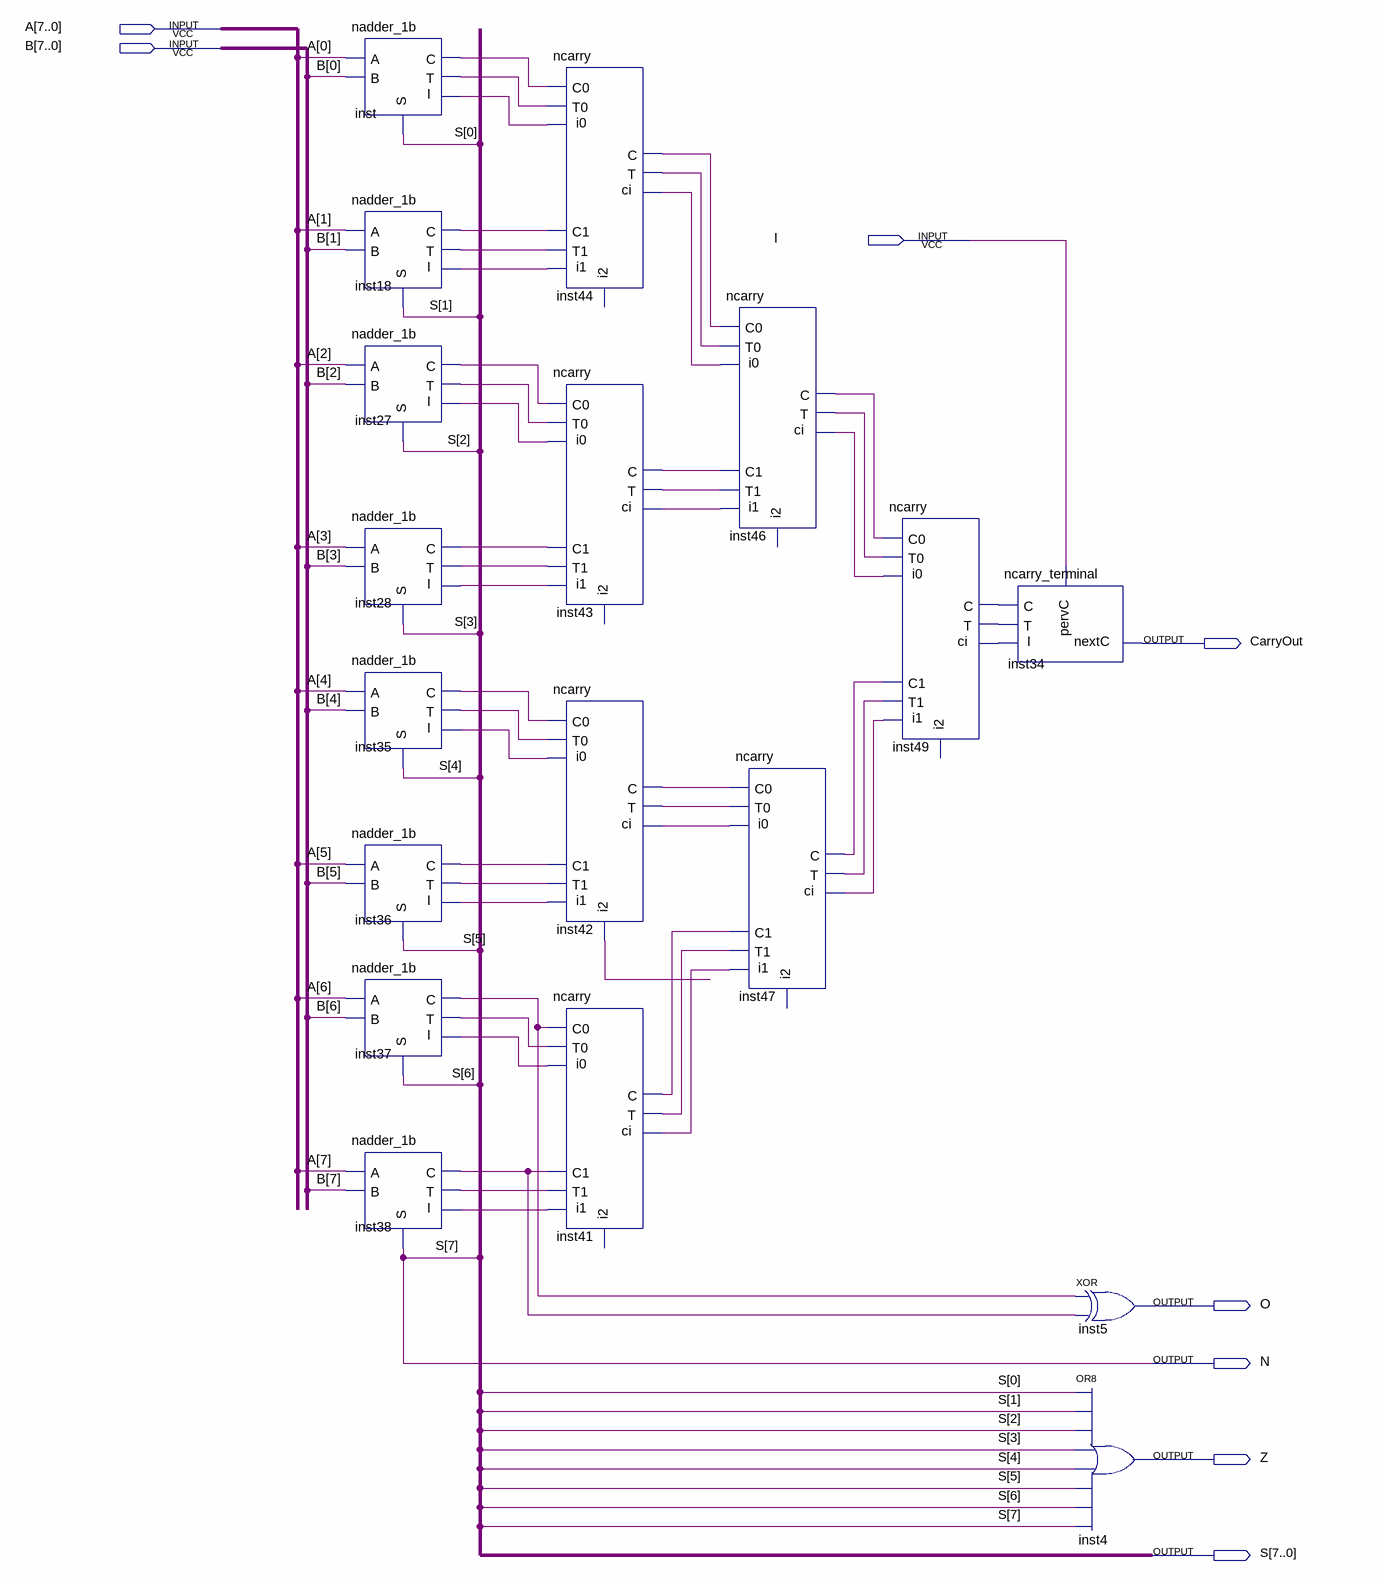
[diagram p0: schematic sheet]
// Quartus schematic nested_adder_8b.bdf as structural Verilog: 18 symbols, 8 pins
module nested_adder_8b (
  input  [7:0] A,
  input  [7:0] B,
  input  I,
  output CarryOut,
  output O,
  output N,
  output Z,
  output [7:0] S
);

  wire inst18_c, inst18_t, inst27_c, inst27_t, inst28_c, inst28_t, inst34_i, inst35_c, inst35_t, inst36_c,
       inst36_t, inst37_c, inst37_t, inst38_c, inst38_t, inst41_c, inst41_i0, inst41_i1, inst41_t, inst42_c,
       inst42_i0, inst42_i1, inst42_i2, inst42_t, inst43_c, inst43_i0, inst43_i1, inst43_t, inst44_c,
       inst44_i0, inst44_i1, inst44_t, inst46_c, inst46_i0, inst46_i1, inst46_t, inst47_c, inst47_i0,
       inst47_i1, inst47_t, inst49_c, inst49_i0, inst49_i1, inst49_t, inst_c, inst_t;

  nadder_1b inst (.A(A[0]), .B(B[0]), .I(inst44_i0), .T(inst_t), .S(S[0]), .C(inst_c));
  nadder_1b inst18 (.A(A[1]), .B(B[1]), .I(inst44_i1), .T(inst18_t), .S(S[1]), .C(inst18_c));
  nadder_1b inst27 (.A(A[2]), .B(B[2]), .I(inst43_i0), .T(inst27_t), .S(S[2]), .C(inst27_c));
  nadder_1b inst28 (.A(A[3]), .B(B[3]), .I(inst43_i1), .T(inst28_t), .S(S[3]), .C(inst28_c));
  nadder_1b inst35 (.A(A[4]), .B(B[4]), .I(inst42_i0), .T(inst35_t), .S(S[4]), .C(inst35_c));
  nadder_1b inst36 (.A(A[5]), .B(B[5]), .I(inst42_i1), .T(inst36_t), .S(S[5]), .C(inst36_c));
  nadder_1b inst37 (.A(A[6]), .B(B[6]), .I(inst41_i0), .T(inst37_t), .S(S[6]), .C(inst37_c));
  nadder_1b inst38 (.A(A[7]), .B(B[7]), .I(inst41_i1), .T(inst38_t), .S(N), .C(inst38_c));
  ncarry inst44 (
    .ci(inst46_i0), .C0(inst_c), .T0(inst_t), .C1(inst18_c), .T1(inst18_t), .i0(inst44_i0), .i1(inst44_i1),
    .T(inst44_t), .C(inst44_c));  // open: i2
  ncarry inst43 (
    .ci(inst46_i1), .C0(inst27_c), .T0(inst27_t), .C1(inst28_c), .T1(inst28_t), .i0(inst43_i0),
    .i1(inst43_i1), .T(inst43_t), .C(inst43_c));  // open: i2
  ncarry inst42 (
    .ci(inst47_i0), .C0(inst35_c), .T0(inst35_t), .C1(inst36_c), .T1(inst36_t), .i0(inst42_i0),
    .i1(inst42_i1), .i2(inst42_i2), .T(inst42_t), .C(inst42_c));
  ncarry inst41 (
    .ci(inst47_i1), .C0(inst37_c), .T0(inst37_t), .C1(inst38_c), .T1(inst38_t), .i0(inst41_i0),
    .i1(inst41_i1), .T(inst41_t), .C(inst41_c));  // open: i2
  ncarry inst46 (
    .ci(inst49_i0), .C0(inst44_c), .T0(inst44_t), .C1(inst43_c), .T1(inst43_t), .i0(inst46_i0),
    .i1(inst46_i1), .T(inst46_t), .C(inst46_c));  // open: i2
  ncarry inst47 (
    .ci(inst49_i1), .C0(inst42_c), .T0(inst42_t), .C1(inst41_c), .T1(inst41_t), .i0(inst47_i0),
    .i1(inst47_i1), .T(inst47_t), .C(inst47_c));  // open: i2
  ncarry inst49 (
    .ci(inst34_i), .C0(inst46_c), .T0(inst46_t), .C1(inst47_c), .T1(inst47_t), .i0(inst49_i0),
    .i1(inst49_i1), .T(inst49_t), .C(inst49_c));  // open: i2
  ncarry_terminal inst34 (.pervC(I), .T(inst49_t), .C(inst49_c), .I(inst34_i), .nextC(CarryOut));
  xor inst5 (O, inst37_c, inst38_c);
  or inst4 (Z, S[0], S[1], S[2], S[3], S[4], S[5], S[6], N);

  assign S[7] = N;
endmodule
